# EAGLE schematic Sequencer - 8 Step - Cigar Box (EAGLE 6.6.0)

## Sheet 1 of 5: Power
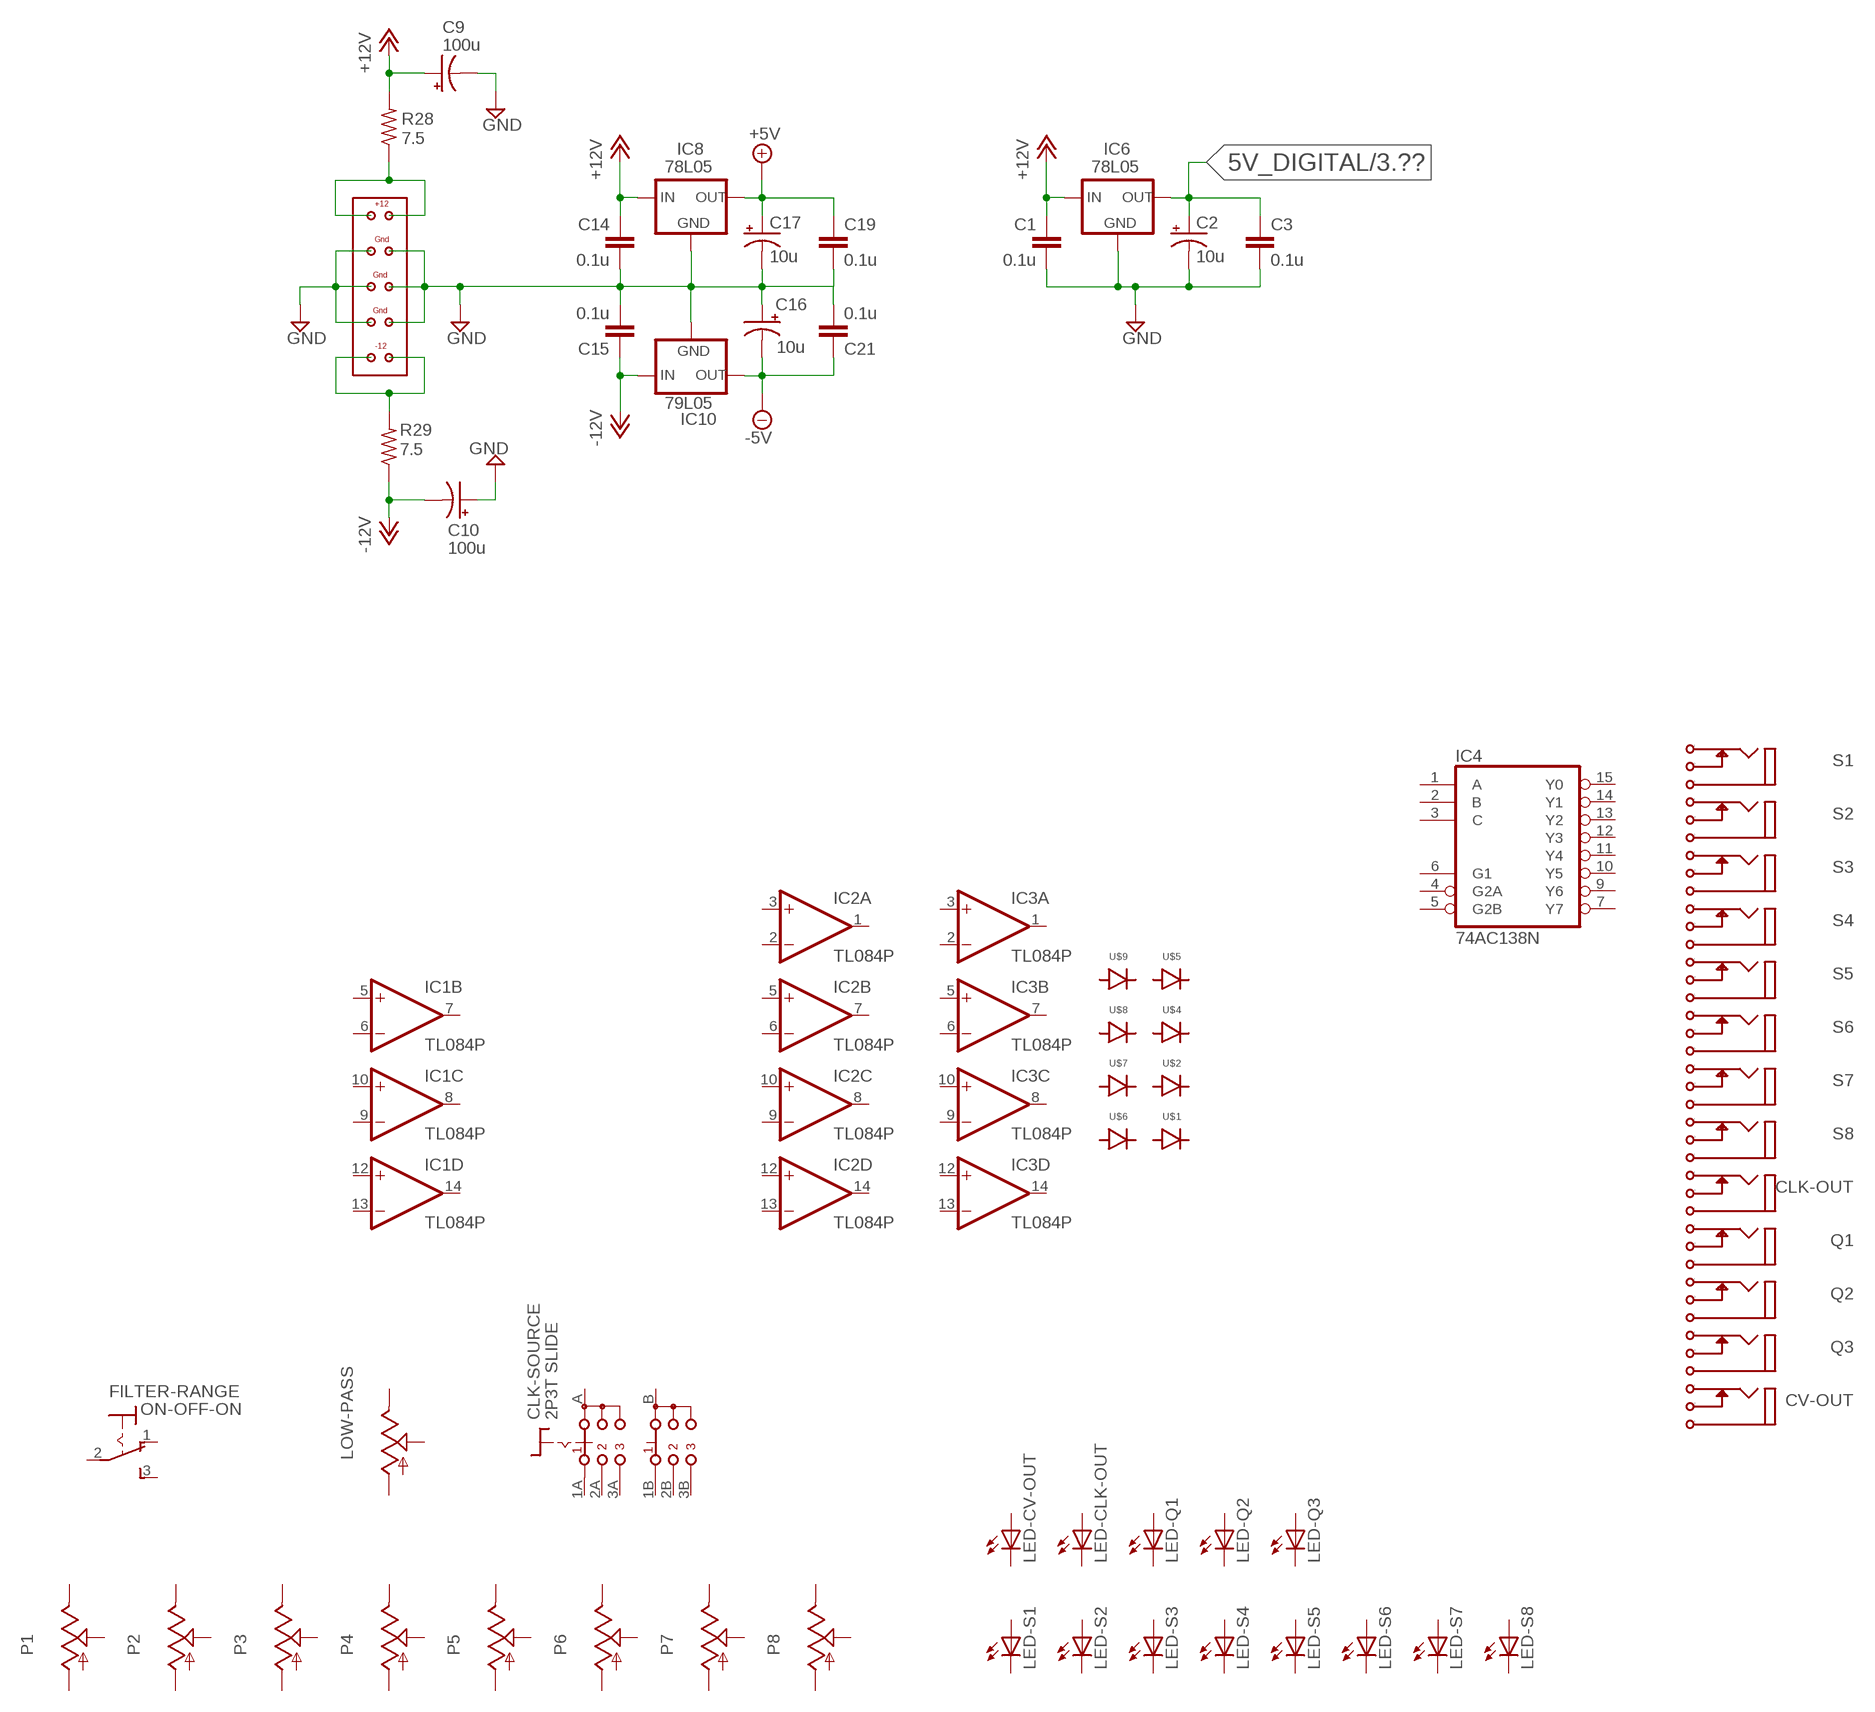
[diagram p0: schematic, sheet 1]

### Parts
C1  0.1u  C-EU025-050X050  [C025-050X050]
C2  10u  CPOL-USE3.5-10  [E3,5-10]
C3  0.1u  C-EU025-050X050  [C025-050X050]
C9  100u  CPOL-USE3.5-10  [E3,5-10]
C10  100u  CPOL-USE3.5-10  [E3,5-10]
C14  0.1u  C-EU025-050X050  [C025-050X050]
C15  0.1u  C-EU025-050X050  [C025-050X050]
C16  10u  CPOL-USE3.5-10  [E3,5-10]
C17  10u  CPOL-USE3.5-10  [E3,5-10]
C19  0.1u  C-EU025-050X050  [C025-050X050]
C21  0.1u  C-EU025-050X050  [C025-050X050]
CLK-OUT  I/O  MONO_JACK  [MONO_JACK]
CLK-SOURCE  2P3T SLIDE  ELMA-01-2X3  [ELMA-01-2X3]
CV-OUT  I/O  MONO_JACK  [MONO_JACK]
FILTER-RANGE  ON-OFF-ON  320-916  [320-916]
IC1  TL084P  [DIL14]
IC2  TL084P  [DIL14]
IC3  TL084P  [DIL14]
IC4  74AC138N  [DIL16]
IC6  78L05  78LXX  [78LXX]
IC8  78L05  78LXX  [78LXX]
IC10  79L05  79LXX  [79LXX]
LED-CLK-OUT  TLLG4400  [LED3MM]
LED-CV-OUT  TLLG4400  [LED3MM]
LED-Q1  TLLG4400  [LED3MM]
LED-Q2  TLLG4400  [LED3MM]
LED-Q3  TLLG4400  [LED3MM]
LED-S1  TLLG4400  [LED3MM]
LED-S2  TLLG4400  [LED3MM]
LED-S3  TLLG4400  [LED3MM]
LED-S4  TLLG4400  [LED3MM]
LED-S5  TLLG4400  [LED3MM]
LED-S6  TLLG4400  [LED3MM]
LED-S7  TLLG4400  [LED3MM]
LED-S8  TLLG4400  [LED3MM]
LOW-PASS  TRIM_US-B64Y  [B64Y]
P1  TRIM_US-B64Y  [B64Y]
P2  TRIM_US-B64Y  [B64Y]
P3  TRIM_US-B64Y  [B64Y]
P4  TRIM_US-B64Y  [B64Y]
P5  TRIM_US-B64Y  [B64Y]
P6  TRIM_US-B64Y  [B64Y]
P7  TRIM_US-B64Y  [B64Y]
P8  TRIM_US-B64Y  [B64Y]
Q1  I/O  MONO_JACK  [MONO_JACK]
Q2  I/O  MONO_JACK  [MONO_JACK]
Q3  I/O  MONO_JACK  [MONO_JACK]
R28  7.5  R-US_0204/7  [0204/7]
R29  7.5  R-US_0204/7  [0204/7]
S1  I/O  MONO_JACK  [MONO_JACK]
S2  I/O  MONO_JACK  [MONO_JACK]
S3  I/O  MONO_JACK  [MONO_JACK]
S4  I/O  MONO_JACK  [MONO_JACK]
S5  I/O  MONO_JACK  [MONO_JACK]
S6  I/O  MONO_JACK  [MONO_JACK]
S7  I/O  MONO_JACK  [MONO_JACK]
S8  I/O  MONO_JACK  [MONO_JACK]
U$1  DIODE-0204/5  [DIODE-0204/5]
U$2  DIODE-0204/5  [DIODE-0204/5]
U$4  DIODE-0204/5  [DIODE-0204/5]
U$5  DIODE-0204/5  [DIODE-0204/5]
U$6  DIODE-0204/5  [DIODE-0204/5]
U$7  DIODE-0204/5  [DIODE-0204/5]
U$8  DIODE-0204/5  [DIODE-0204/5]
U$9  DIODE-0204/5  [DIODE-0204/5]
U$10  EURORACK-POWER  [EURORACK-POWER]

### Nets
5V_DIGITAL: C2.+ C3.1 IC6.OUT ; also sheet 3
+5V: C17.+ C19.1 IC8.OUT
+12V: C1.1 C9.+ C14.1 IC6.IN IC8.IN R28.2 ; also sheet 2
-5V: C16.- C21.1 IC10.OUT
-12V: C10.- C15.1 IC10.IN R29.1
GND: C1.2 C2.- C3.2 C9.- C10.+ C14.2 C15.2 C16.+ C17.- C19.2 C21.2 IC6.GND IC8.GND IC10.GND U$10.P$3 U$10.P$4 U$10.P$5 U$10.P$6 U$10.P$7 U$10.P$8 ; also sheet 2,3
N$36: R28.1 U$10.P$1 U$10.P$2
N$37: R29.2 U$10.P$9 U$10.P$10
Unconnected: CLK-OUT.P$1 CLK-OUT.P$2(P2) CLK-OUT.P$3(P3) CLK-SOURCE.1A(A1) CLK-SOURCE.1B(B1) CLK-SOURCE.2A(A2) CLK-SOURCE.2B(B2) CLK-SOURCE.3A(A3) CLK-SOURCE.3B(B3) CLK-SOURCE.A CLK-SOURCE.B CV-OUT.P$1 CV-OUT.P$2(P2) CV-OUT.P$3(P3) FILTER-RANGE.1(O) FILTER-RANGE.2(P) FILTER-RANGE.3(S) IC1.5(B:+IN) IC1.6(B:-IN) IC1.7(B:OUT) IC1.8(C:OUT) IC1.9(C:-IN) IC1.10(C:+IN) IC1.12(D:+IN) IC1.13(D:-IN) IC1.14(D:OUT) IC2.1(A:OUT) IC2.2(A:-IN) IC2.3(A:+IN) IC2.5(B:+IN) IC2.6(B:-IN) IC2.7(B:OUT) IC2.8(C:OUT) IC2.9(C:-IN) IC2.10(C:+IN) IC2.12(D:+IN) IC2.13(D:-IN) IC2.14(D:OUT) IC3.1(A:OUT) IC3.2(A:-IN) IC3.3(A:+IN) IC3.5(B:+IN) IC3.6(B:-IN) IC3.7(B:OUT) IC3.8(C:OUT) IC3.9(C:-IN) IC3.10(C:+IN) IC3.12(D:+IN) IC3.13(D:-IN) IC3.14(D:OUT) IC4.1(A) IC4.2(B) IC4.3(C) IC4.4(G2A) IC4.5(G2B) IC4.6(G1) IC4.7(Y7) IC4.9(Y6) IC4.10(Y5) IC4.11(Y4) IC4.12(Y3) IC4.13(Y2) IC4.14(Y1) IC4.15(Y0) LED-CLK-OUT.A LED-CLK-OUT.K(C) LED-CV-OUT.A LED-CV-OUT.K(C) LED-Q1.A LED-Q1.K(C) LED-Q2.A LED-Q2.K(C) LED-Q3.A LED-Q3.K(C) LED-S1.A LED-S1.K(C) LED-S2.A LED-S2.K(C) LED-S3.A LED-S3.K(C) LED-S4.A LED-S4.K(C) LED-S5.A LED-S5.K(C) LED-S6.A LED-S6.K(C) LED-S7.A LED-S7.K(C) LED-S8.A LED-S8.K(C) LOW-PASS.A LOW-PASS.E LOW-PASS.S P1.A P1.E P1.S P2.A P2.E P2.S P3.A P3.E P3.S P4.A P4.E P4.S P5.A P5.E P5.S P6.A P6.E P6.S P7.A P7.E P7.S P8.A P8.E P8.S Q1.P$1 Q1.P$2(P2) Q1.P$3(P3) Q2.P$1 Q2.P$2(P2) Q2.P$3(P3) Q3.P$1 Q3.P$2(P2) Q3.P$3(P3) S1.P$1 S1.P$2(P2) S1.P$3(P3) S2.P$1 S2.P$2(P2) S2.P$3(P3) S3.P$1 S3.P$2(P2) S3.P$3(P3) S4.P$1 S4.P$2(P2) S4.P$3(P3) S5.P$1 S5.P$2(P2) S5.P$3(P3) S6.P$1 S6.P$2(P2) S6.P$3(P3) S7.P$1 S7.P$2(P2) S7.P$3(P3) S8.P$1 S8.P$2(P2) S8.P$3(P3) U$1.ANODE U$1.CATHODE U$2.ANODE U$2.CATHODE U$4.ANODE U$4.CATHODE U$5.ANODE U$5.CATHODE U$6.ANODE U$6.CATHODE U$7.ANODE U$7.CATHODE U$8.ANODE U$8.CATHODE U$9.ANODE U$9.CATHODE

## Sheet 2 of 5: Rotary Switch 7-Segment LED control and reset signal routing
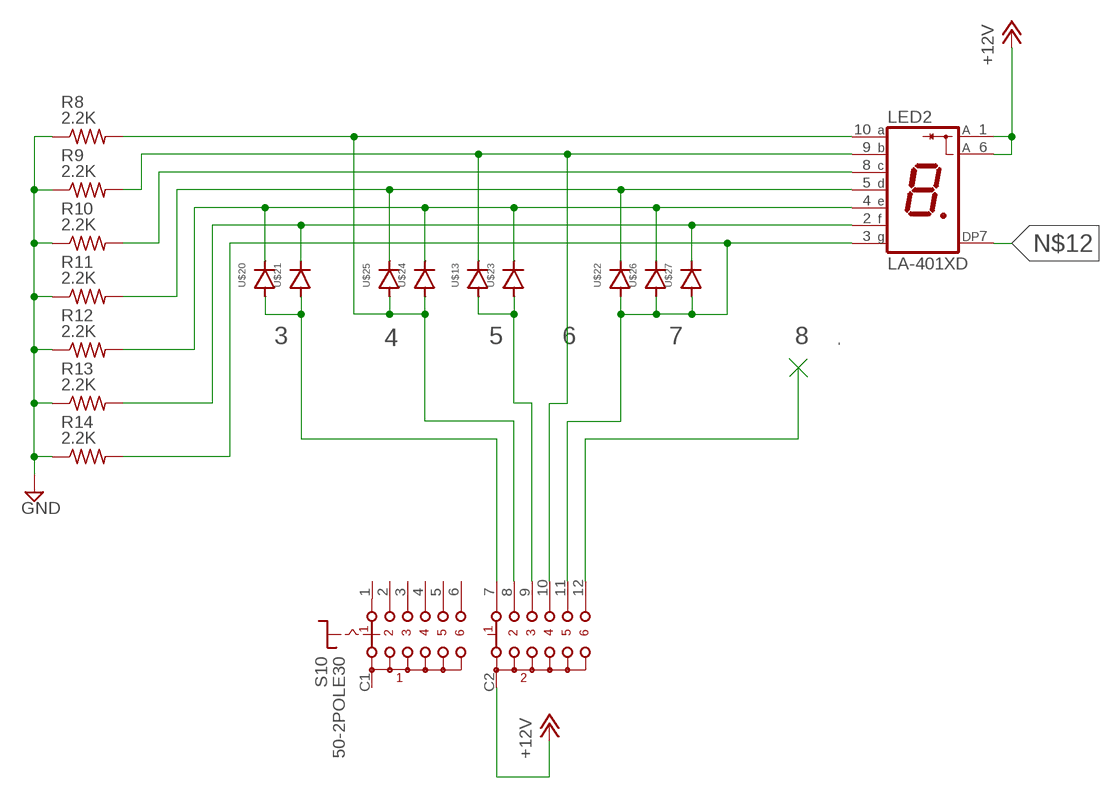
[diagram p1: schematic, sheet 2]

### Parts
LED2  LA-401XD  [LA-401]
R8  2.2K  R-US_R0603  [R0603]
R9  2.2K  R-US_R0603  [R0603]
R10  2.2K  R-US_R0603  [R0603]
R11  2.2K  R-US_R0603  [R0603]
R12  2.2K  R-US_R0603  [R0603]
R13  2.2K  R-US_R0603  [R0603]
R14  2.2K  R-US_R0603  [R0603]
S10  50-2POLE30  [50-2POLE30]
U$13  DIODE-0204/5  [DIODE-0204/5]
U$20  DIODE-0204/5  [DIODE-0204/5]
U$21  DIODE-0204/5  [DIODE-0204/5]
U$22  DIODE-0204/5  [DIODE-0204/5]
U$23  DIODE-0204/5  [DIODE-0204/5]
U$24  DIODE-0204/5  [DIODE-0204/5]
U$25  DIODE-0204/5  [DIODE-0204/5]
U$26  DIODE-0204/5  [DIODE-0204/5]
U$27  DIODE-0204/5  [DIODE-0204/5]

### Nets
+12V: LED2.1(A) LED2.6(A) S10.C2(S2) ; also sheet 1
GND: R8.1 R9.1 R10.1 R11.1 R12.1 R13.1 R14.1 ; also sheet 1,3
N$12: LED2.7(DP)
N$13: LED2.9(B) R9.2 S10.10 U$13.CATHODE
N$14: LED2.8(C) R10.2
N$15: LED2.5(D) R11.2 U$22.CATHODE U$25.CATHODE
N$16: LED2.4(E) R12.2 U$20.CATHODE U$23.CATHODE U$24.CATHODE U$26.CATHODE
N$17: LED2.2(F) R13.2 U$21.CATHODE U$27.CATHODE
N$18: S10.7 U$20.ANODE U$21.ANODE
N$19: LED2.10(A) R8.2 S10.8 U$24.ANODE U$25.ANODE
N$20: S10.9 U$13.ANODE U$23.ANODE
N$21: LED2.3(G) R14.2 S10.11 U$22.ANODE U$26.ANODE U$27.ANODE
N$22: S10.12
Unconnected: S10.1 S10.2 S10.3 S10.4 S10.5 S10.6 S10.C1(S1)

### Notes on the sheet
- 3 | 4 | 5 | 6 | 7 | 8

## Sheet 3 of 5: Clock Internal VCO, external clock, and clock output
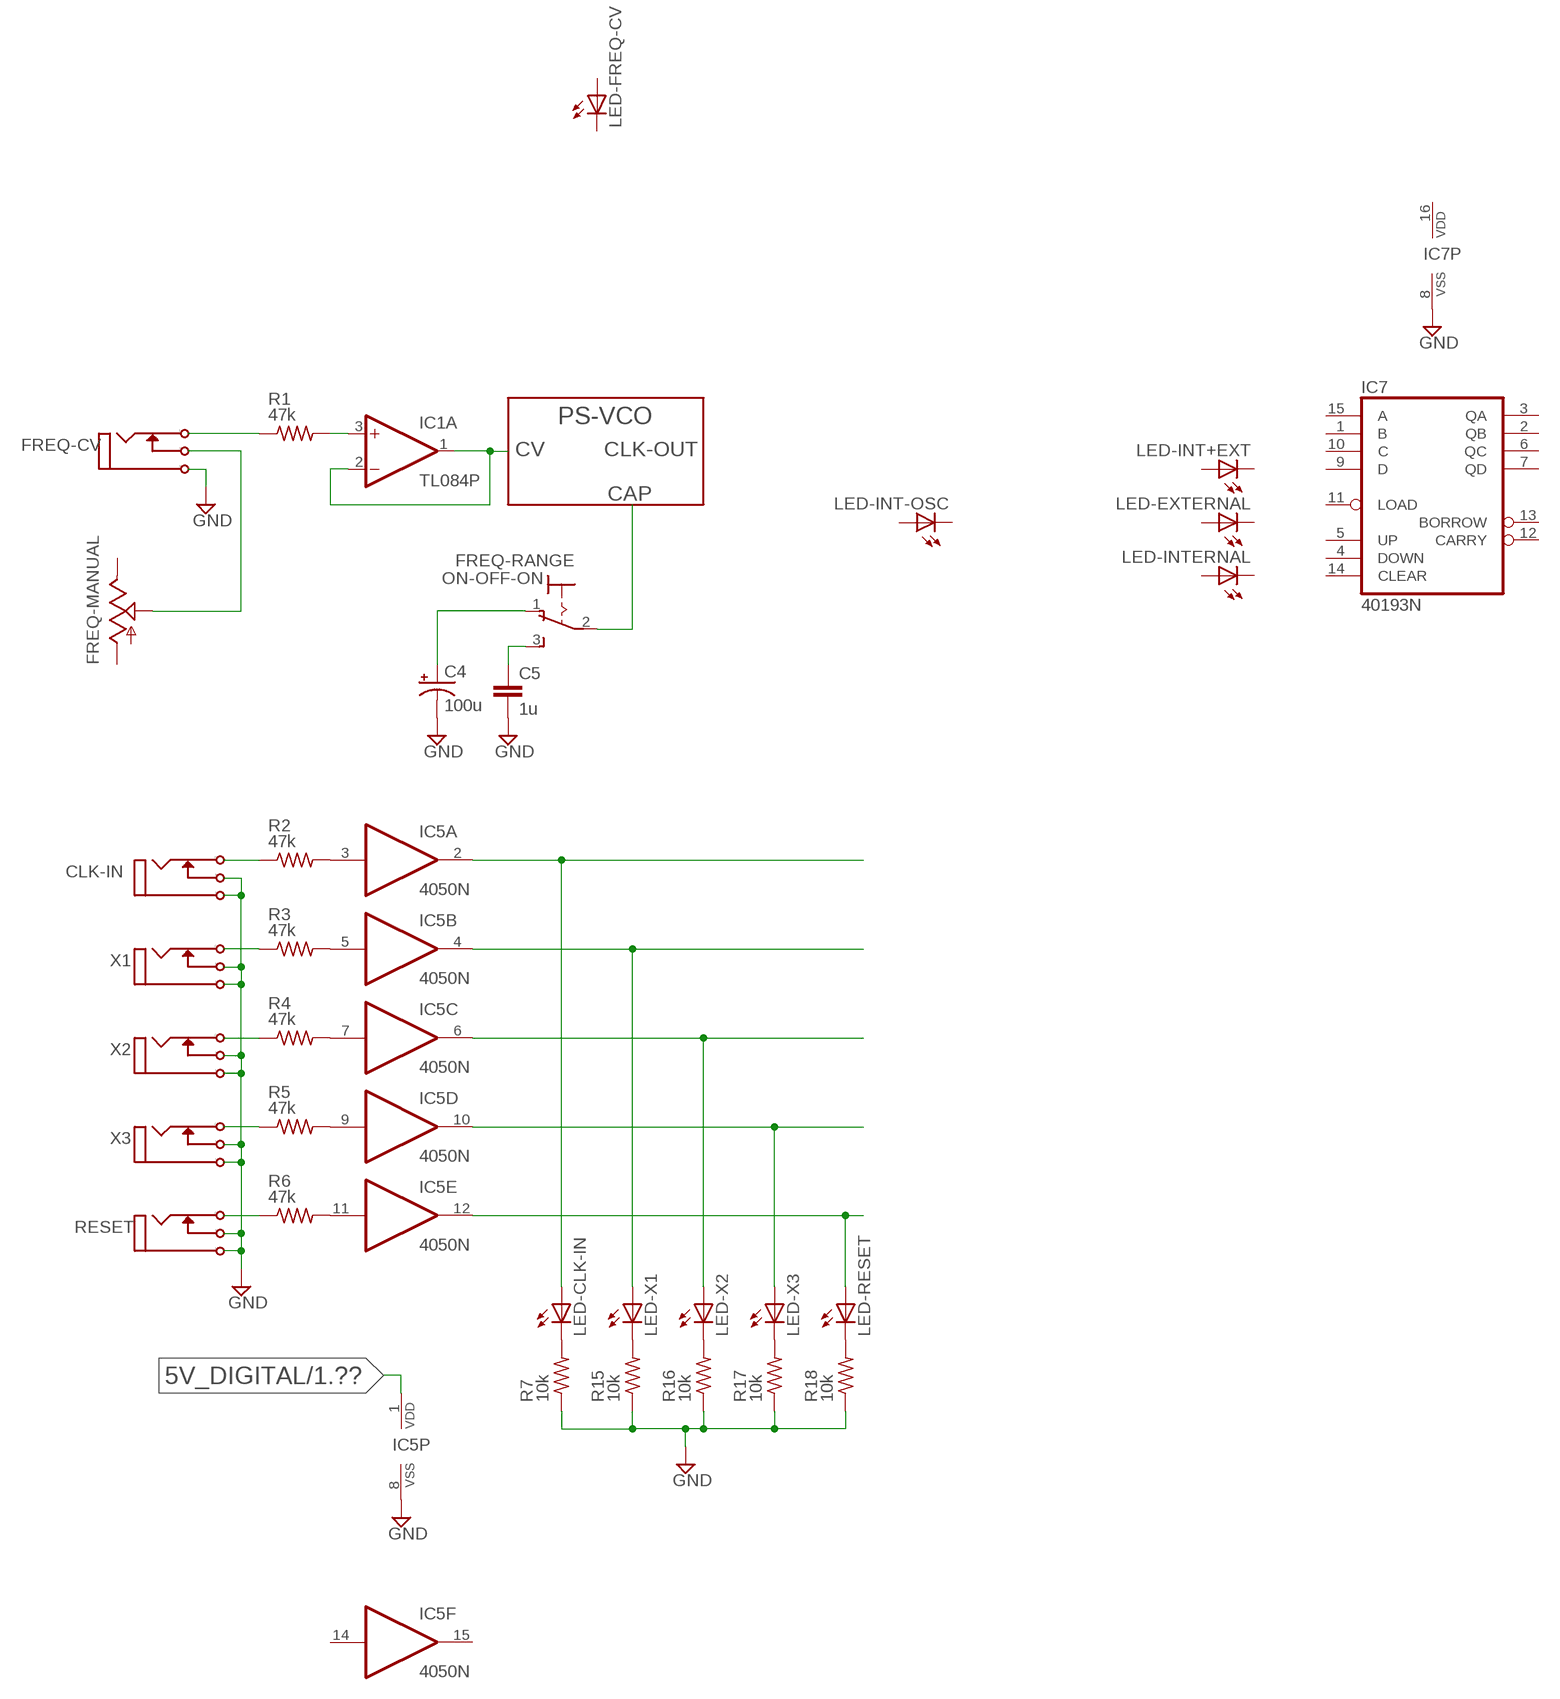
[diagram p2: schematic, sheet 3]

### Parts
C4  100u  CPOL-USE3.5-10  [E3,5-10]
C5  1u  C-EU025-050X050  [C025-050X050]
CLK-IN  I/O  MONO_JACK  [MONO_JACK]
FREQ-CV  I/O  MONO_JACK  [MONO_JACK]
FREQ-MANUAL  TRIM_US-B64Y  [B64Y]
FREQ-RANGE  ON-OFF-ON  320-916  [320-916]
IC5  4050N  [DIL16]
IC7  40193N  [DIL16]
LED-CLK-IN  TLLG4400  [LED3MM]
LED-EXTERNAL  TLLG4400  [LED3MM]
LED-FREQ-CV  TLLG4400  [LED3MM]
LED-INT+EXT  TLLG4400  [LED3MM]
LED-INT-OSC  TLLG4400  [LED3MM]
LED-INTERNAL  TLLG4400  [LED3MM]
LED-RESET  TLLG4400  [LED3MM]
LED-X1  TLLG4400  [LED3MM]
LED-X2  TLLG4400  [LED3MM]
LED-X3  TLLG4400  [LED3MM]
R1  47k  R-US_R0603  [R0603]
R2  47k  R-US_R0603  [R0603]
R3  47k  R-US_R0603  [R0603]
R4  47k  R-US_R0603  [R0603]
R5  47k  R-US_R0603  [R0603]
R6  47k  R-US_R0603  [R0603]
R7  10k  R-US_R0603  [R0603]
R15  10k  R-US_R0603  [R0603]
R16  10k  R-US_R0603  [R0603]
R17  10k  R-US_R0603  [R0603]
R18  10k  R-US_R0603  [R0603]
RESET  I/O  MONO_JACK  [MONO_JACK]
X1  I/O  MONO_JACK  [MONO_JACK]
X2  I/O  MONO_JACK  [MONO_JACK]
X3  I/O  MONO_JACK  [MONO_JACK]

### Nets
5V_DIGITAL: IC5.1(P:VDD) ; also sheet 1
GND: C4.- C5.2 CLK-IN.P$1 CLK-IN.P$3(P3) FREQ-CV.P$1 IC5.8(P:VSS) IC7.8(VSS) R7.1 R15.1 R16.1 R17.1 R18.1 RESET.P$1 RESET.P$3(P3) X1.P$1 X1.P$3(P3) X2.P$1 X2.P$3(P3) X3.P$1 X3.P$3(P3) ; also sheet 1,2
N$1: IC1.3(A:+IN) R1.2
N$2: FREQ-CV.P$2(P2) R1.1
N$3: IC1.1(A:OUT) IC1.2(A:-IN)
N$4: IC5.3(A:I) R2.2
N$5: FREQ-CV.P$3(P3) FREQ-MANUAL.S
N$6: IC5.5(B:I) R3.2
N$7: IC5.7(C:I) R4.2
N$8: IC5.9(D:I) R5.2
N$9: IC5.11(E:I) R6.2
N$10: IC5.12(E:O) LED-RESET.A
N$11: IC5.10(D:O) LED-X3.A
N$23: IC5.6(C:O) LED-X2.A
N$24: IC5.4(B:O) LED-X1.A
N$25: IC5.2(A:O) LED-CLK-IN.A
N$26: CLK-IN.P$2(P2) R2.1
N$27: R3.1 X1.P$2(P2)
N$28: R4.1 X2.P$2(P2)
N$29: R5.1 X3.P$2(P2)
N$30: R6.1 RESET.P$2(P2)
N$31: LED-CLK-IN.K(C) R7.2
N$32: LED-X1.K(C) R15.2
N$33: LED-X2.K(C) R16.2
N$34: LED-X3.K(C) R17.2
N$35: LED-RESET.K(C) R18.2
N$38: FREQ-RANGE.2(P)
N$39: C5.1 FREQ-RANGE.3(S)
N$40: C4.+ FREQ-RANGE.1(O)
Unconnected: FREQ-MANUAL.A FREQ-MANUAL.E IC5.14(F:I) IC5.15(F:O) IC7.1(B) IC7.2(QB) IC7.3(QA) IC7.4(DOWN) IC7.5(UP) IC7.6(QC) IC7.7(QD) IC7.9(D) IC7.10(C) IC7.11(LOAD) IC7.12(CARRY) IC7.13(BORROW) IC7.14(CLEAR) IC7.15(A) LED-EXTERNAL.A LED-EXTERNAL.K(C) LED-FREQ-CV.A LED-FREQ-CV.K(C) LED-INT+EXT.A LED-INT+EXT.K(C) LED-INT-OSC.A LED-INT-OSC.K(C) LED-INTERNAL.A LED-INTERNAL.K(C)

### Notes on the sheet
- PS-VCO
- CV | CLK-OUT
- CAP

## Sheet 4 of 5

## Sheet 5 of 5

## Power pins joined to a net without a drawn wire
GND: IC4.8(GND)
V+: IC1.4(P:V+) IC2.4(P:V+) IC3.4(P:V+)
V-: IC1.11(P:V-) IC2.11(P:V-) IC3.11(P:V-)
VCC: IC4.16(VCC)
VDD: IC7.16(VDD)

## Library data of the parts
C1 C3 C5 C14 C15 C19 C21 = resistor:C-EU: CAPACITOR, European symbol
C2 C4 C9 C10 C16 C17 = rcl:CPOL-US: POLARIZED CAPACITOR, American symbol
CLK-IN CLK-OUT CV-OUT FREQ-CV Q1-Q3 RESET S1-S8 X1-X3 = !synth_sch:MONO_JACK
CLK-SOURCE = switch:ELMA-01-2X3: Rotary Switches Type 01 Source: http://www.elma.com/files/products/rotary_components/pdfs/rotary_switches_type_01_002.pdf
FILTER-RANGE FREQ-RANGE = switch:320-916: TOGGLE SWITCH distributor RS Components
FREQ-MANUAL LOW-PASS P1-P8 = pot:TRIM_US-: POTENTIOMETER
IC1-IC3 = linear:TL084: OP AMP
IC4 = 74xx-eu:74*138: 3-line to 8-line DECODER/DEMULTIPLEXER
IC5 = 40xx:4050: Hex non-inverting BUFFER
IC6 IC8 = v-reg:78LXX: VOLTAGE REGULATOR
IC7 = 40xx:40193: Binary up down COUNTER
IC10 = v-reg:79LXX: VOLTAGE REGULATOR
LED2 = led-7-segment:LA-401*D: Single Digit LED Numeric Display (anode common) Source: ROHM .. la-1401dn.pdf; OC_FARNELL: unknown; OC_NEWARK: unknown
LED-CLK-IN LED-CLK-OUT LED-CV-OUT LED-EXTERNAL LED-FREQ-CV LED-INT+EXT LED-INT-OSC LED-INTERNAL LED-Q1-LED-Q3 LED-RESET LED-S1-LED-S8 LED-X1-LED-X3 = led:TLLG4400: Low Current (2mA) LED 3 mm Tinted Diffused Package color GREEN Source: Data sheet <http://www.farnell.com/datasheets/391098.pdf>; MF: VISHAY SEMICONDUCTOR; OC_FARNELL: 1612435
R1-R18 = rcl:R-US_: RESISTOR, American symbol
R28 R29 = resistor:R-US_: RESISTOR, American symbol
S10 = switch:50-2POLE30: SERIES 50 Single-Deck Rotary Switches two pole 30° Source: www.grayhill.com .. J-15-21.pdf
U$1 U$2 U$4-U$9 U$13 U$20-U$27 = !synth_sch:DIODE-0204/5
U$10 = !synth_sch:EURORACK-POWER